# EAGLE design cpc_gal_addon_128k (EAGLE 6.4)
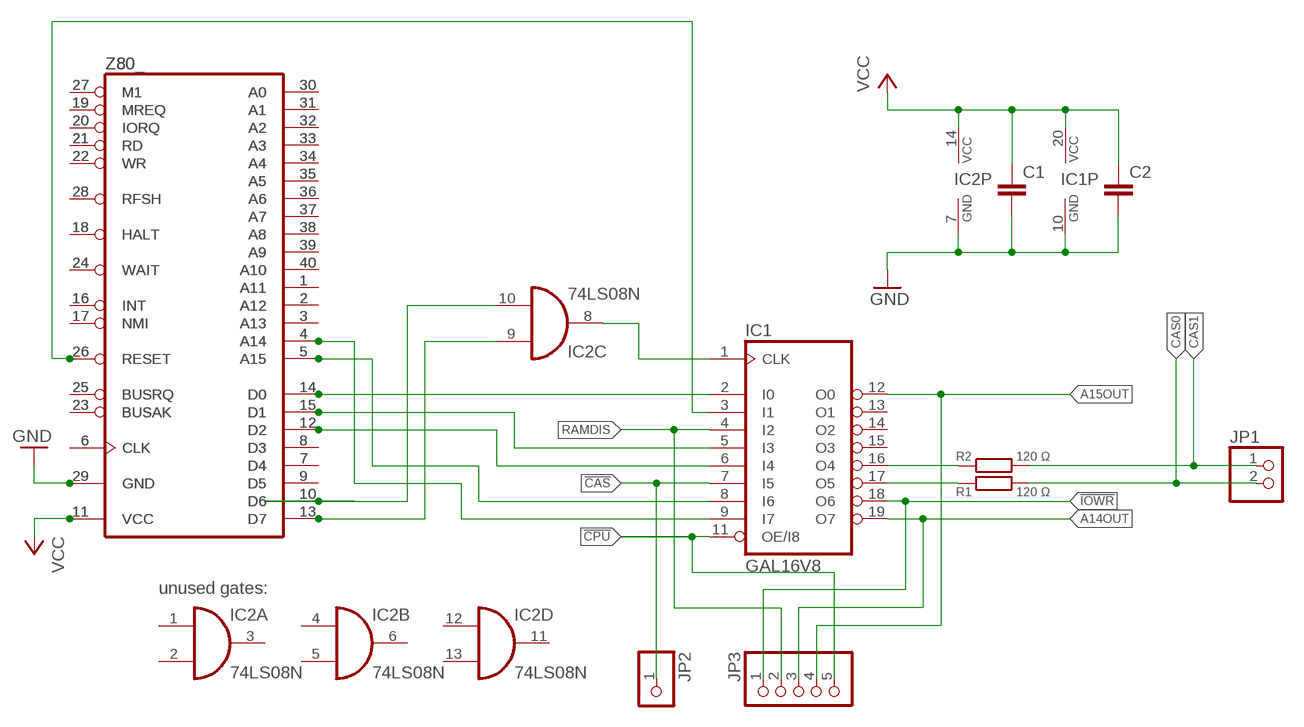
[diagram p0: schematic, sheet 1]

## Parts
C1  C-EU025-025X050  [C025-025X050]
C2  C-EU025-025X050  [C025-025X050]
IC1  GAL16V8  16V8  [DIL20]
IC2  74LS08N  74AC08N  [DIL14]
JP1  PINHD-1X2  [1X02]
JP2  PINHD-1X1  [1X01]
JP3  PINHD-1X5  [1X05]
R1  120 Ω  R-EU_0204/5  [0204/5]
R2  120 Ω  R-EU_0204/5  [0204/5]
Z80  Z80CPU  [DIL40]
Z80_  Z80CPU  [DIL40]

## Nets
!CAS: IC1.7(I5) JP2.1
!CPU: IC1.11(OE/I8) JP3.5
!IOWR: IC1.18(O6) JP3.1
A14OUT: IC1.19(O7) JP3.3
A15OUT: IC1.12(O0) JP3.4
CAS0: JP1.2 R1.2
CAS1: JP1.1 R2.2
GND: C1.2 C2.2 IC1.10(GND) IC2.7(P:GND) Z80.29(GND) Z80_.29(GND)
N$1: IC2.9(C:I0) Z80.13(D7) Z80_.13(D7)
N$2: IC2.10(C:I1) Z80.10(D6) Z80_.10(D6)
N$3: IC1.1(CLK) IC2.8(C:O)
N$4: IC1.2(I0) Z80.14(D0) Z80_.14(D0)
N$5: IC1.3(I1) Z80.26(RESET) Z80_.26(RESET)
N$6: IC1.5(I3) Z80.15(D1) Z80_.15(D1)
N$7: IC1.6(I4) Z80.12(D2) Z80_.12(D2)
N$8: IC1.8(I6) Z80.5(A15) Z80_.5(A15)
N$9: IC1.9(I7) Z80.4(A14) Z80_.4(A14)
N$10: IC1.17(O5) R1.1
N$11: IC1.16(O4) R2.1
N$12: Z80.30(A0) Z80_.30(A0)
N$13: Z80.31(A1) Z80_.31(A1)
N$14: Z80.32(A2) Z80_.32(A2)
N$15: Z80.33(A3) Z80_.33(A3)
N$16: Z80.34(A4) Z80_.34(A4)
N$17: Z80.35(A5) Z80_.35(A5)
N$18: Z80.36(A6) Z80_.36(A6)
N$19: Z80.37(A7) Z80_.37(A7)
N$20: Z80.38(A8) Z80_.38(A8)
N$21: Z80.39(A9) Z80_.39(A9)
N$22: Z80.40(A10) Z80_.40(A10)
N$23: Z80.1(A11) Z80_.1(A11)
N$24: Z80.2(A12) Z80_.2(A12)
N$25: Z80.3(A13) Z80_.3(A13)
N$26: Z80.8(D3) Z80_.8(D3)
N$27: Z80.7(D4) Z80_.7(D4)
N$28: Z80.9(D5) Z80_.9(D5)
N$29: Z80.27(M1) Z80_.27(M1)
N$30: Z80.19(MREQ) Z80_.19(MREQ)
N$31: Z80.20(IORQ) Z80_.20(IORQ)
N$32: Z80.21(RD) Z80_.21(RD)
N$33: Z80.22(WR) Z80_.22(WR)
N$34: Z80.28(RFSH) Z80_.28(RFSH)
N$35: Z80.18(HALT) Z80_.18(HALT)
N$36: Z80.24(WAIT) Z80_.24(WAIT)
N$37: Z80.16(INT) Z80_.16(INT)
N$38: Z80.17(NMI) Z80_.17(NMI)
N$39: Z80.25(BUSRQ) Z80_.25(BUSRQ)
N$40: Z80.23(BUSAK) Z80_.23(BUSAK)
N$41: Z80.6(CLK) Z80_.6(CLK)
RAMDIS: IC1.4(I2) JP3.2
VCC: C1.1 C2.1 IC1.20(VCC) IC2.14(P:VCC) Z80.11(VCC) Z80_.11(VCC)
Unconnected: IC1.13(O1) IC1.14(O2) IC1.15(O3) IC2.1(A:I0) IC2.2(A:I1) IC2.3(A:O) IC2.4(B:I0) IC2.5(B:I1) IC2.6(B:O) IC2.11(D:O) IC2.12(D:I0) IC2.13(D:I1)

## Notes on the sheet
- unused gates:

## Library data of the parts
C1 C2 = rcl:C-EU: CAPACITOR, European symbol
IC1 = pal:16V8: PAL; MPN: GAL16V8D-7LPN; OC_FARNELL: 9699740; OC_NEWARK: 97K0449
IC2 = 74xx-eu:74*08: Quad 2-input AND gate
JP1 = pinhead:PINHD-1X2: PIN HEADER
JP2 = pinhead:PINHD-1X1: PIN HEADER
JP3 = pinhead:PINHD-1X5: PIN HEADER
R1 R2 = rcl:R-EU_: RESISTOR, European symbol
Z80 Z80_ = zilog:Z80CPU: Z80 FAMILY DEVICE

## Board
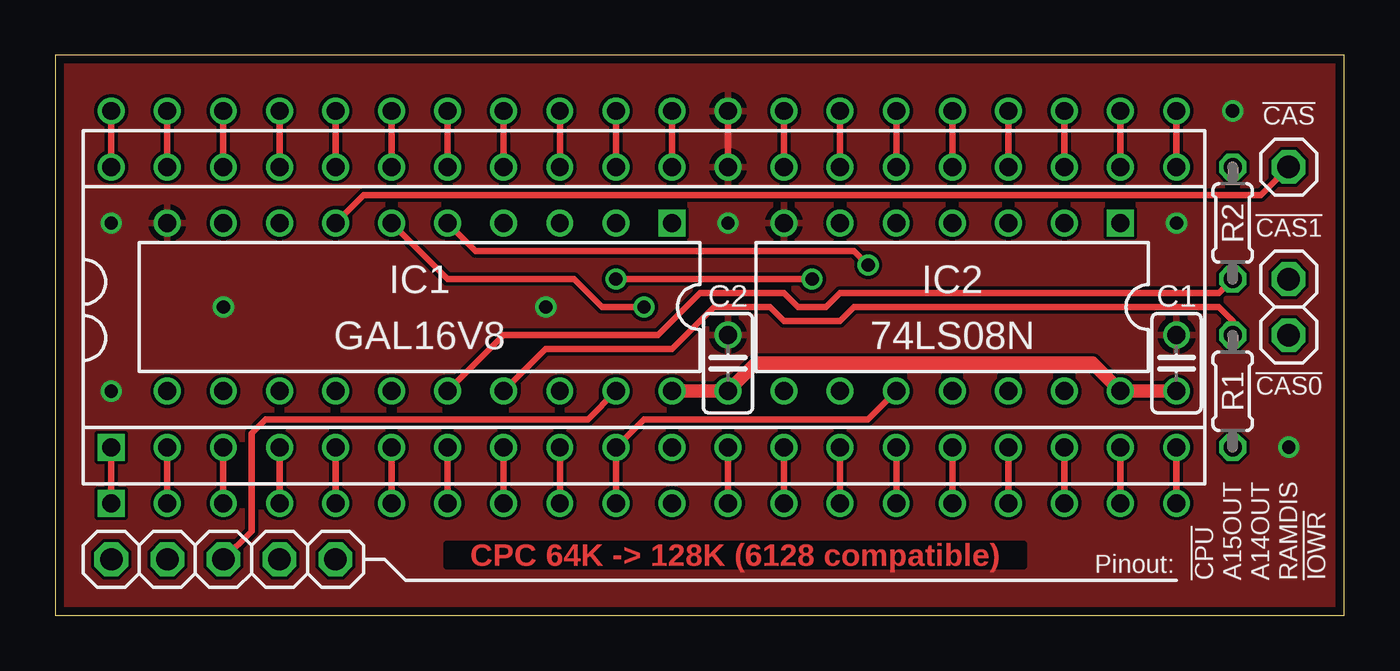
[diagram p1: board, top side]
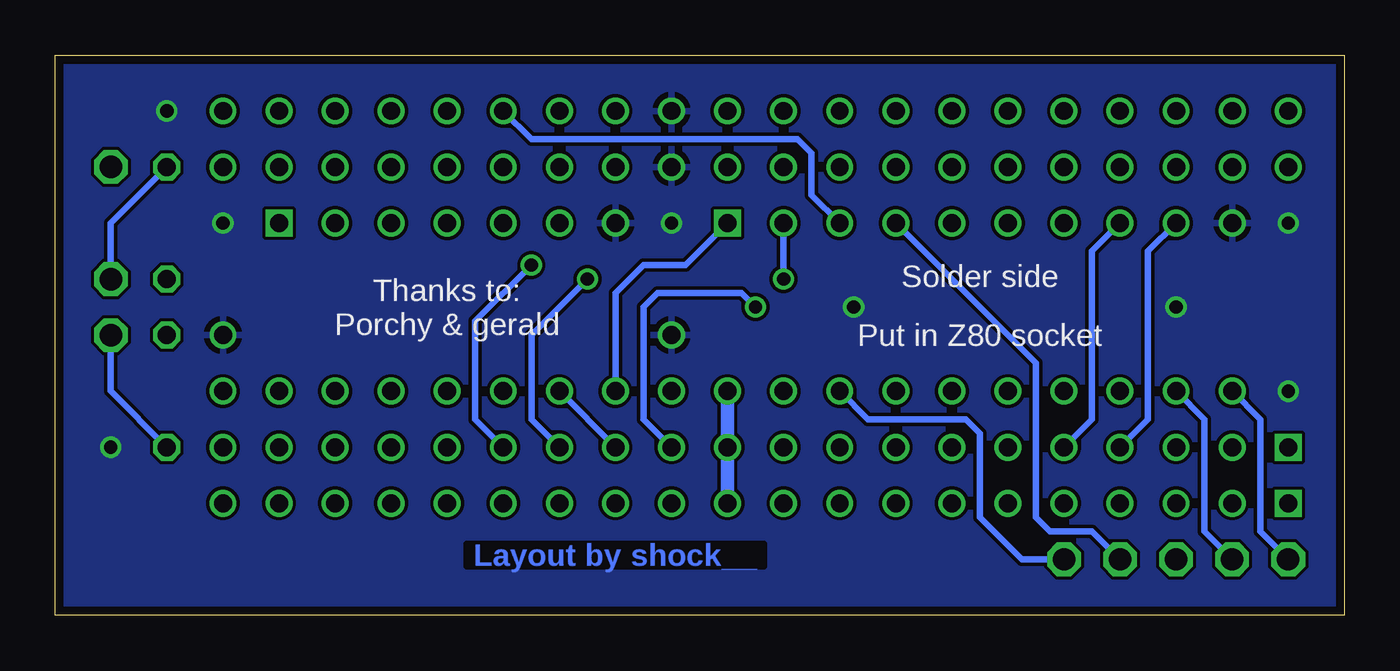
[diagram p2: board, bottom side, seen from below]

Size 58.4 x 25.39 mm. Coordinates in mm from the lower left corner, seen from the top.
Outline: 0,0 58.4,0 58.4,25.39 0,25.39 0,0
Copper layers (1*16): Top 0.0356mm / dielectric 1.5011mm / Bottom 0.0356mm
Design rules "oshpark-2layer *": minimum track width 6mil, minimum drill 13mil, track to track 6mil, track to pad 6mil, pad to pad 6mil, via to via 6mil, smd to smd 6mil, copper to edge 15mil, drill to drill 6mil, minimum pad ring 7mil, minimum via ring 7mil, stop-mask expansion 2.5mil, vias tented up to drill 0.9556mm, thermal gap 10mil

### Footprints (pad centres in the part's own frame; a part is rotated, then mirrored left to right if it is on the bottom)
C025-025X050 = drill 0.813: 1 -1.27,0; 2 1.27,0
DIL20 = drill 0.813 square: 1 -11.43,-3.81 | drill 0.813: 2 -8.89,-3.81; 3 -6.35,-3.81; 4 -3.81,-3.81; 5 -1.27,-3.81; 6 1.27,-3.81; 7 3.81,-3.81; 8 6.35,-3.81; 9 8.89,-3.81; 10 11.43,-3.81; 11 11.43,3.81; 12 8.89,3.81; 13 6.35,3.81; 14 3.81,3.81; 15 1.27,3.81; 16 -1.27,3.81; 17 -3.81,3.81; 18 -6.35,3.81; 19 -8.89,3.81; 20 -11.43,3.81
DIL14 = drill 0.813 square: 1 -7.62,-3.81 | drill 0.813: 2 -5.08,-3.81; 3 -2.54,-3.81; 4 0,-3.81; 5 2.54,-3.81; 6 5.08,-3.81; 7 7.62,-3.81; 8 7.62,3.81; 9 5.08,3.81; 10 2.54,3.81; 11 0,3.81; 12 -2.54,3.81; 13 -5.08,3.81; 14 -7.62,3.81
1X02 = drill 1.016 octagon: 1 -1.27,0; 2 1.27,0
1X01 = drill 1.016 octagon: 1 0,0
1X05 = drill 1.016 octagon: 1 -5.08,0; 2 -2.54,0; 3 0,0; 4 2.54,0; 5 5.08,0
0204/5 = drill 0.813 octagon: 1 -2.54,0; 2 2.54,0
DIL40 = drill 0.813 square: 1 -24.13,-7.62 | drill 0.813: 2 -21.59,-7.62; 3 -19.05,-7.62; 4 -16.51,-7.62; 5 -13.97,-7.62; 6 -11.43,-7.62; 7 -8.89,-7.62; 8 -6.35,-7.62; 9 -3.81,-7.62; 10 -1.27,-7.62; 11 1.27,-7.62; 12 3.81,-7.62; 13 6.35,-7.62; 14 8.89,-7.62; 15 11.43,-7.62; 16 13.97,-7.62; 17 16.51,-7.62; 18 19.05,-7.62; 19 21.59,-7.62; 20 24.13,-7.62; 21 24.13,7.62; 22 21.59,7.62; 23 19.05,7.62; 24 16.51,7.62; 25 13.97,7.62; 26 11.43,7.62; 27 8.89,7.62; 28 6.35,7.62; 29 3.81,7.62; 30 1.27,7.62; 31 -1.27,7.62; 32 -3.81,7.62; 33 -6.35,7.62; 34 -8.89,7.62; 35 -11.43,7.62; 36 -13.97,7.62; 37 -16.51,7.62; 38 -19.05,7.62; 39 -21.59,7.62; 40 -24.13,7.62

### Placement (x,y rotation side)
C1  50.8,11.43 90 top
C2  30.48,11.43 90 top
IC1  16.51,13.97 180 top
IC2  40.64,13.97 180 top
JP1  55.88,13.97 270 top
JP2  55.88,20.32 0 top
JP3  7.62,2.54 180 top
R1  53.34,10.16 270 top
R2  53.34,17.78 90 top
Z80  26.67,15.24 0 top
Z80_  26.67,12.7 0 top

### Tracks (layer width: path | path; a pad name or v marks a point on that pad's centre or on a via)
!CAS
  Top 0.305: IC1.7 13.97,19.05 54.61,19.05 JP2.1
!CPU
  Bottom 0.305: IC1.11 3.81,8.89 3.81,3.81 JP3.5
!IOWR
  Bottom 0.305: IC1.18 21.59,8.89 17.14,8.89 16.51,8.26 16.51,4.45 14.61,2.54 JP3.1
A14OUT
  Top 0.305: IC1.19 24.13,8.89 9.53,8.89 8.89,8.26 8.89,3.81 JP3.3
A15OUT
  Bottom 0.305: IC1.12 6.35,8.89 6.35,3.81 JP3.4
CAS0
  Bottom 0.305: R1.2 55.88,10.16 JP1.2
CAS1
  Bottom 0.305: R2.2 55.88,17.78 JP1.1
GND  (via drill 0.6)
  Top 0.305: Z80_.29 Z80.29
  other vias: 22.23,13.97 30.48,17.78 2.54,17.78 2.54,10.16 50.8,17.78 55.88,7.62 7.62,13.97 53.34,22.86
  pour Top: 0,25.4 0,0 58.42,0 58.42,25.4
  pour Bottom: 0,25.4 0,0 58.42,0 58.42,25.4
N$1
  Top 0.305: Z80_.13 Z80.13
  Bottom 0.305: Z80.13 IC2.9
N$2
  Top 0.305: IC2.10 36.83,8.89 26.67,8.89 Z80.10 Z80_.10
N$3
  Bottom 0.305: IC1.1 29.84,15.88 31.75,15.88 33.02,14.61 IC2.8
N$4  (via drill 0.6)
  Top 0.305: v34.29,15.24 26.04,15.24 v25.4,15.24 | Z80_.14 Z80.14
  Bottom 0.305: Z80.14 36.83,8.89 36.83,12.7 v34.29,15.24 | v25.4,15.24 IC1.2
N$5
  Top 0.305: Z80_.26 Z80.26
  Bottom 0.305: IC1.3 24.13,19.05 24.13,20.95 24.77,21.59 36.83,21.59 Z80.26
N$6  (via drill 0.6)
  Top 0.305: IC1.5 19.05,16.51 36.2,16.51 v36.83,15.88 | Z80_.15 Z80.15
  Bottom 0.305: v36.83,15.88 39.37,13.34 39.37,8.89 Z80.15
N$7  (via drill 0.6)
  Top 0.305: v26.67,13.97 24.77,13.97 23.5,15.24 17.78,15.24 IC1.6 | Z80_.12 Z80.12
  Bottom 0.305: Z80.12 31.75,8.89 31.75,13.97 31.11,14.61 27.3,14.61 v26.67,13.97
N$8
  Top 0.305: Z80_.5 Z80.5
  Bottom 0.305: Z80.5 11.43,8.89 11.43,16.51 IC1.8
N$9
  Top 0.305: Z80_.4 Z80.4
  Bottom 0.305: Z80.4 8.89,8.89 8.89,16.51 IC1.9
N$10
  Top 0.305: IC1.17 22.23,12.06 27.94,12.06 29.84,13.97 32.38,13.97 33.02,13.34 35.56,13.34 36.2,13.97 52.07,13.97 52.7,13.97 53.34,13.34 R1.1
N$11
  Top 0.305: IC1.16 20.32,12.7 27.3,12.7 29.21,14.61 33.02,14.61 33.66,13.97 34.92,13.97 35.56,14.61 52.7,14.61 R2.1
N$12
  Top 0.305: Z80_.30 Z80.30
N$13
  Top 0.305: Z80.31 Z80_.31
N$14
  Top 0.305: Z80.32 Z80_.32
N$15
  Top 0.305: Z80.33 Z80_.33
N$16
  Top 0.305: Z80.34 Z80_.34
N$17
  Top 0.305: Z80.35 Z80_.35
N$18
  Top 0.305: Z80.36 Z80_.36
N$19
  Top 0.305: Z80.37 Z80_.37
N$20
  Top 0.305: Z80.38 Z80_.38
N$21
  Top 0.305: Z80.39 Z80_.39
N$22
  Top 0.305: Z80.40 Z80_.40
N$23
  Top 0.305: Z80_.1 Z80.1
N$24
  Top 0.305: Z80_.2 Z80.2
N$25
  Top 0.305: Z80_.3 Z80.3
N$26
  Top 0.305: Z80_.8 Z80.8
N$27
  Top 0.305: Z80_.7 Z80.7
N$28
  Top 0.305: Z80_.9 Z80.9
N$29
  Top 0.305: Z80_.27 Z80.27
N$30
  Top 0.305: Z80_.19 Z80.19
N$31
  Top 0.305: Z80_.20 Z80.20
N$32
  Top 0.305: Z80_.21 Z80.21
N$33
  Top 0.305: Z80_.22 Z80.22
N$34
  Top 0.305: Z80_.28 Z80.28
N$35
  Top 0.305: Z80_.18 Z80.18
N$36
  Top 0.305: Z80_.24 Z80.24
N$37
  Top 0.305: Z80_.16 Z80.16
N$38
  Top 0.305: Z80_.17 Z80.17
N$39
  Top 0.305: Z80_.25 Z80.25
N$40
  Top 0.305: Z80_.23 Z80.23
N$41
  Top 0.305: Z80_.6 Z80.6
RAMDIS
  Bottom 0.305: IC1.4 13.97,11.43 13.97,4.45 13.34,3.81 11.43,3.81 JP3.2
VCC
  Top 0.61: IC1.20 C2.1 31.75,11.43 46.99,11.43 IC2.14 C1.1
  Bottom 0.61: Z80_.11 Z80.11 IC1.20

### Text on the board
Top: CPC 64K -> 128K (6128 compatible)
Bottom: Layout by shock__
tPlace: !CAS | !CAS1 | !CAS0 | Pinout: | !CPU | A15OUT | A14OUT | RAMDIS | !IOWR
bPlace: Solder side | Thanks to: / Porchy & gerald | Put in Z80 socket
tStop: CPC 64K -> 128K (6128 compatible)
bStop: Layout by shock__